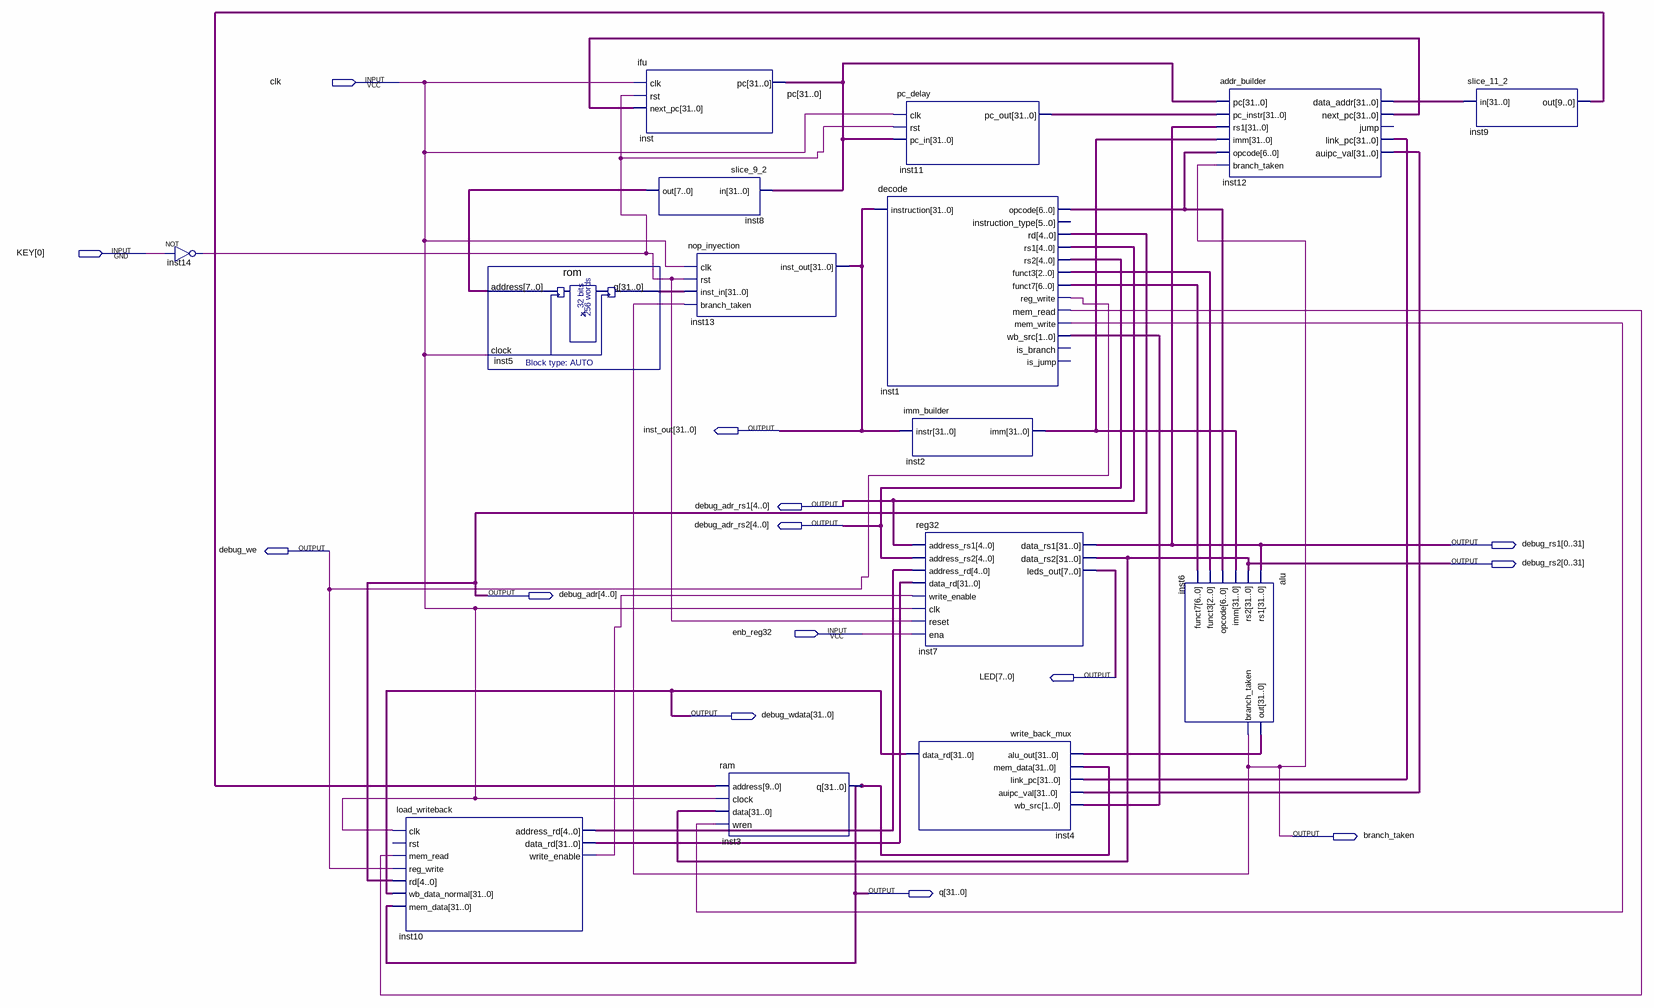
[diagram p0: schematic sheet]
// Quartus schematic uc2026.bdf as structural Verilog: 15 symbols, 14 pins
module uc2026 (
  input  clk,
  input  [0:0] KEY,
  input  enb_reg32,
  output [31:0] inst_out,
  output [4:0] debug_adr_rs1,
  output [4:0] debug_adr_rs2,
  output [0:31] debug_rs1,
  output debug_we,
  output [0:31] debug_rs2,
  output [4:0] debug_adr,
  output [7:0] LED,
  output [31:0] debug_wdata,
  output branch_taken,
  output [31:0] q
);

  wire inst1_mem_read, inst1_mem_write, inst10_write_enable, inst14_out;
  wire [1:0] inst1_wb_src;
  wire [2:0] inst1_funct3;
  wire [4:0] inst10_address_rd;
  wire [6:0] inst1_funct7, inst1_opcode;
  wire [7:0] inst8_out;
  wire [9:0] inst9_out;
  wire [31:0] inst2_imm, inst5_q, inst6_out, inst10_data_rd, inst11_pc_out, inst12_auipc_val,
       inst12_data_addr, inst12_link_pc, inst12_next_pc, pc;

  not inst14 (inst14_out, KEY[0]);
  load_writeback inst10 (
    .clk(clk), .mem_read(inst1_mem_read), .reg_write(debug_we), .rd(debug_adr), .wb_data_normal(debug_wdata),
    .mem_data(q), .address_rd(inst10_address_rd), .data_rd(inst10_data_rd), .write_enable(inst10_write_enable));  // open: rst
  rom inst5 (.address(inst8_out), .clock(clk), .q(inst5_q));
  ifu inst (.clk(clk), .rst(inst14_out), .next_pc(inst12_next_pc), .pc(pc));
  slice_9_2 inst8 (.in(pc), .out(inst8_out));
  nop_inyection inst13 (
    .clk(clk), .rst(inst14_out), .inst_in(inst5_q), .branch_taken(branch_taken), .inst_out(inst_out));
  ram inst3 (.address(inst9_out), .clock(clk), .data(debug_rs2), .wren(inst1_mem_write), .q(q));
  pc_delay inst11 (.clk(clk), .rst(inst14_out), .pc_in(pc), .pc_out(inst11_pc_out));
  decode inst1 (
    .instruction(inst_out), .opcode(inst1_opcode), .rd(debug_adr), .rs1(debug_adr_rs1), .rs2(debug_adr_rs2),
    .funct3(inst1_funct3), .funct7(inst1_funct7), .reg_write(debug_we), .mem_read(inst1_mem_read),
    .mem_write(inst1_mem_write), .wb_src(inst1_wb_src));  // open: instruction_type, is_branch, is_jump
  imm_builder inst2 (.instr(inst_out), .imm(inst2_imm));
  reg32 inst7 (
    .address_rs1(debug_adr_rs1), .address_rs2(debug_adr_rs2), .address_rd(inst10_address_rd),
    .data_rd(inst10_data_rd), .write_enable(inst10_write_enable), .clk(clk), .reset(inst14_out),
    .ena(enb_reg32), .data_rs1(debug_rs1), .data_rs2(debug_rs2), .leds_out(LED));
  write_back_mux inst4 (
    .alu_out(inst6_out), .mem_data(q), .link_pc(inst12_link_pc), .auipc_val(inst12_auipc_val),
    .wb_src(inst1_wb_src), .data_rd(debug_wdata));
  alu inst6 (
    .rs1(debug_rs1), .rs2(debug_rs2), .imm(inst2_imm), .opcode(inst1_opcode), .funct3(inst1_funct3),
    .funct7(inst1_funct7), .out(inst6_out), .branch_taken(branch_taken));
  addr_builder inst12 (
    .pc(pc), .pc_instr(inst11_pc_out), .rs1(debug_rs1), .imm(inst2_imm), .opcode(inst1_opcode),
    .branch_taken(branch_taken), .data_addr(inst12_data_addr), .next_pc(inst12_next_pc),
    .link_pc(inst12_link_pc), .auipc_val(inst12_auipc_val));  // open: jump
  slice_11_2 inst9 (.in(inst12_data_addr), .out(inst9_out));
endmodule
